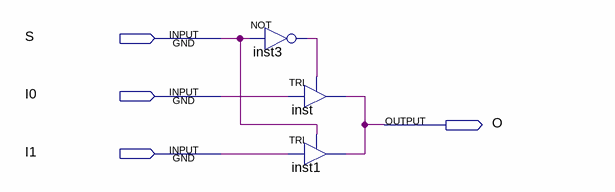
[diagram p0: schematic sheet]
// Quartus schematic mx2_1b.bdf as structural Verilog: 3 symbols, 4 pins
module mx2_1b (
  input  S,
  input  I0,
  input  I1,
  output O
);

  wire inst3_out;

  not inst3 (inst3_out, S);
  TRI inst (.IN(I0), .OE(inst3_out), .OUT(O));
  TRI inst1 (.IN(I1), .OE(S), .OUT(O));
endmodule
